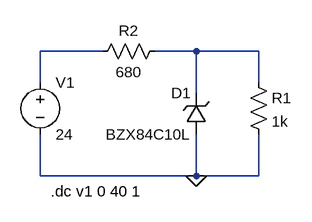
[diagram p0: schematic 2-vr-rl.asc]
2-vr-rl.asc, the LTspice schematic file:
Version 4.1
SHEET 1 880 680
WIRE 176 80 80 80
WIRE 320 80 256 80
WIRE 416 80 320 80
WIRE 80 128 80 80
WIRE 416 128 416 80
WIRE 320 144 320 80
WIRE 80 272 80 208
WIRE 320 272 320 208
WIRE 320 272 80 272
WIRE 416 272 416 208
WIRE 416 272 320 272
FLAG 320 272 0
SYMBOL voltage 80 112 R0
SYMATTR InstName V1
SYMATTR Value 24
SYMBOL zener 336 208 R180
WINDOW 0 24 64 Left 2
WINDOW 3 24 0 Left 2
SYMATTR InstName D1
SYMATTR Value BZX84C10L
SYMBOL res 400 112 R0
SYMATTR InstName R1
SYMATTR Value 1k
SYMBOL res 272 64 R90
WINDOW 0 0 56 VBottom 2
WINDOW 3 32 56 VTop 2
SYMATTR InstName R2
SYMATTR Value 680
TEXT 96 296 Left 2 !.dc v1 0 40 1

The netlist it stands for:
* 2-vr-rl.asc
V1 N001 0 24
D1 0 N002 BZX84C10L
R1 N002 0 1k
R2 N002 N001 680
.model D D
.lib standard.dio
.dc v1 0 40 1
.backanno
.end